# Altium schematic sheet gpio.SchDoc
size A
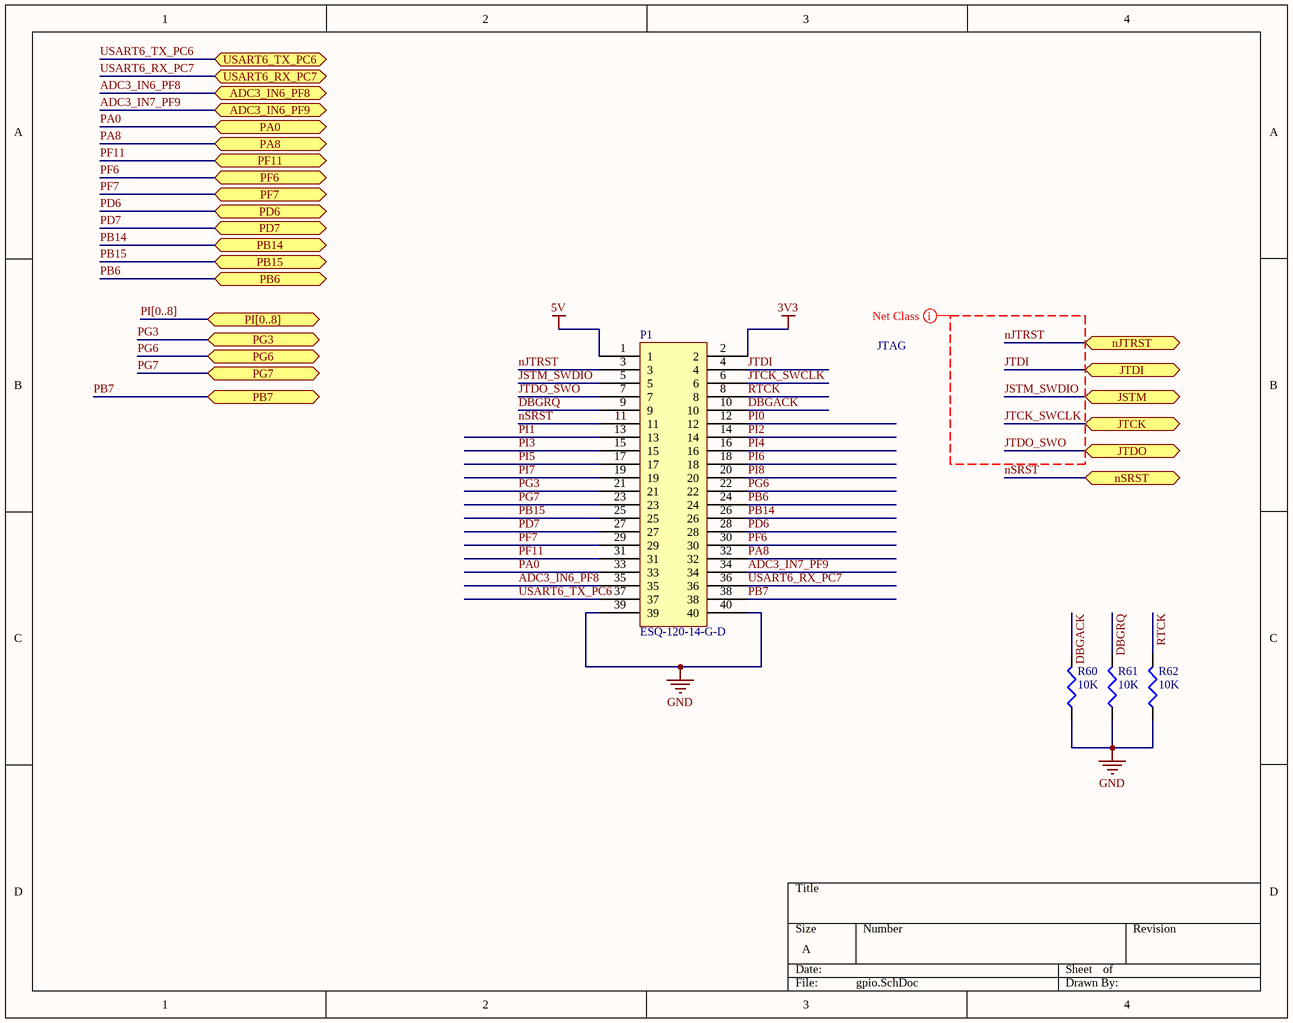
[diagram p0: gpio.SchDoc]

## Parts
P1  ESQ-120-14-G-D  [PBD40]
R60  10K  [R0402]
R61  10K  [R0402]
R62  10K  [R0402]

## Ports
ADC3_IN6_PF8 (bidir), ADC3_IN6_PF9 (bidir), JSTM (bidir), JTCK (bidir), JTDI (bidir), JTDO (bidir), nJTRST (bidir), nSRST (bidir), PA0 (bidir), PA8 (bidir), PB6 (bidir), PB7 (bidir), PB14 (bidir), PB15 (bidir), PD6 (bidir), PD7 (bidir), PF6 (bidir), PF7 (bidir), PF11 (bidir), PG3 (bidir), PG6 (bidir), PG7 (bidir), PI[0..8] (bidir), USART6_RX_PC7 (bidir), USART6_TX_PC6 (bidir)

## Nets
3V3: P1.2
5V: P1.1
GND: P1.39 P1.40 R60.1 R61.1 R62.1
ADC3_IN6_PF8: P1.35 ; port ADC3_IN6_PF8
ADC3_IN7_PF9: P1.34 ; port ADC3_IN6_PF9
DBGACK: P1.10 R60.2
DBGRQ: P1.9 R61.2
JSTM_SWDIO: P1.5 ; port JSTM
JTCK_SWCLK: P1.6 ; port JTCK
JTDI: P1.4 ; port JTDI
JTDO_SWO: P1.7 ; port JTDO
nJTRST: P1.3 ; port nJTRST
nSRST: P1.11 ; port nSRST
PA0: P1.33 ; port PA0
PA8: P1.32 ; port PA8
PB6: P1.24 ; port PB6
PB7: P1.38 ; port PB7
PB14: P1.26 ; port PB14
PB15: P1.25 ; port PB15
PD6: P1.28 ; port PD6
PD7: P1.27 ; port PD7
PF6: P1.30 ; port PF6
PF7: P1.29 ; port PF7
PF11: P1.31 ; port PF11
PG3: P1.21 ; port PG3
PG6: P1.22 ; port PG6
PG7: P1.23 ; port PG7
PI0: P1.12
PI1: P1.13
PI2: P1.14
PI3: P1.15
PI4: P1.16
PI5: P1.17
PI6: P1.18
PI7: P1.19
PI8: P1.20
RTCK: P1.8 R62.2
USART6_RX_PC7: P1.36 ; port USART6_RX_PC7
USART6_TX_PC6: P1.37 ; port USART6_TX_PC6

## Buses and harness runs
bus PI[0..8] = port PI[0..8]

## Layout directives
net class JTAG: JSTM_SWDIO, JTCK_SWCLK, JTDI, JTDO_SWO, nJTRST

## Library data of the parts
P1 = ESQ-120-14-G-D: CONN RCPT 40POS .100" DUAL GOLD; Manufacturer: Samtec Inc.; Connector Type: Receptacle; Number of Positions: 40; Number of Positions Loaded: All; Pitch: 0.100" (2.54mm); .Creator: MM; Supplier 1: Digi-Key; Manufacturer Part Number: ESQ-120-14-G-D; RoHS: RoHS Compliant; Category: Connectors, Interconnects; Stock 1: 51; Pricing 1: 1=7.42, 10=6.864, 50=6.1586, 100=5.7505, 250=5.00852, 500=4.823, 1000=4.6375, 2500=4.452 (USD); Packaging: Tube; Contact Type: Female Socket; Number of Rows: 2; Row Spacing: 0.100" (2.54mm); Mounting Type: Through Hole; Termination: Solder; Fastening Type: -; Features: -; Contact Finish: Gold; Contact Finish Thickness: 20µin (0.51µm); Color: Black; ComponentLink1URL: http://suddendocs.samtec.com/prints/esq-1xx-xx-x-x-xxx-xx-x-xx-mkt.pdf; ComponentLink1Description: http://suddendocs.samtec.com/prints/esq-1xx-xx-x-x-xxx-xx-x-xx-mkt.pdf; Supplier Part Number 1: SAM8767-ND; .Checked PCB: MM; .Checked SCH: MM
R60-R62 = RC0402FR-07100RL: RES 100 OHM 1/16W 1% 0402 SMD; Manufacturer: Yageo; Resistance (Ohms): 100; Power (Watts): 0.063W, 1/16W; Value: 100R; .Checked PCB: RF; Temperature Coefficient: ±100ppm/°C; Category: Resistors; Supplier Part Number: 311-100LRCT-ND; Manufacturer Part Number: RC0402FR-07100RL; Package / Case: 0402 (1005 Metric); Price 1k [$]: 0.01421; Tolerance: ±1%; .Checked SCH: RF; Supplier: Digikey; Supplier 1: Digi-Key; Supplier Part Number 1: 311-100LRCT-ND; RoHS: RoHS Compliant; Stock 1: 1682040; Pricing 1: 10=0.014, 50=0.0104, 100=0.0079, 250=0.00584, 500=0.00432, 1000=0.00288 (USD); Composition: Thick Film; Features: -; Size / Dimension: 0.039" L x 0.020" W (1.00mm x 0.50mm); Height: 0.016" (0.40mm); Number of Terminations: 2; Packaging: Cut Tape (CT); ComponentLink1URL: http://www.yageo.com/documents/recent/PYu-RC0402_51_RoHS_L_6.pdf; ComponentLink1Description: http://www.yageo.com/documents/recent/PYu-RC0402_51_RoHS_L_6.pdf